# Altium project HAB_V01R01.PrjPCB
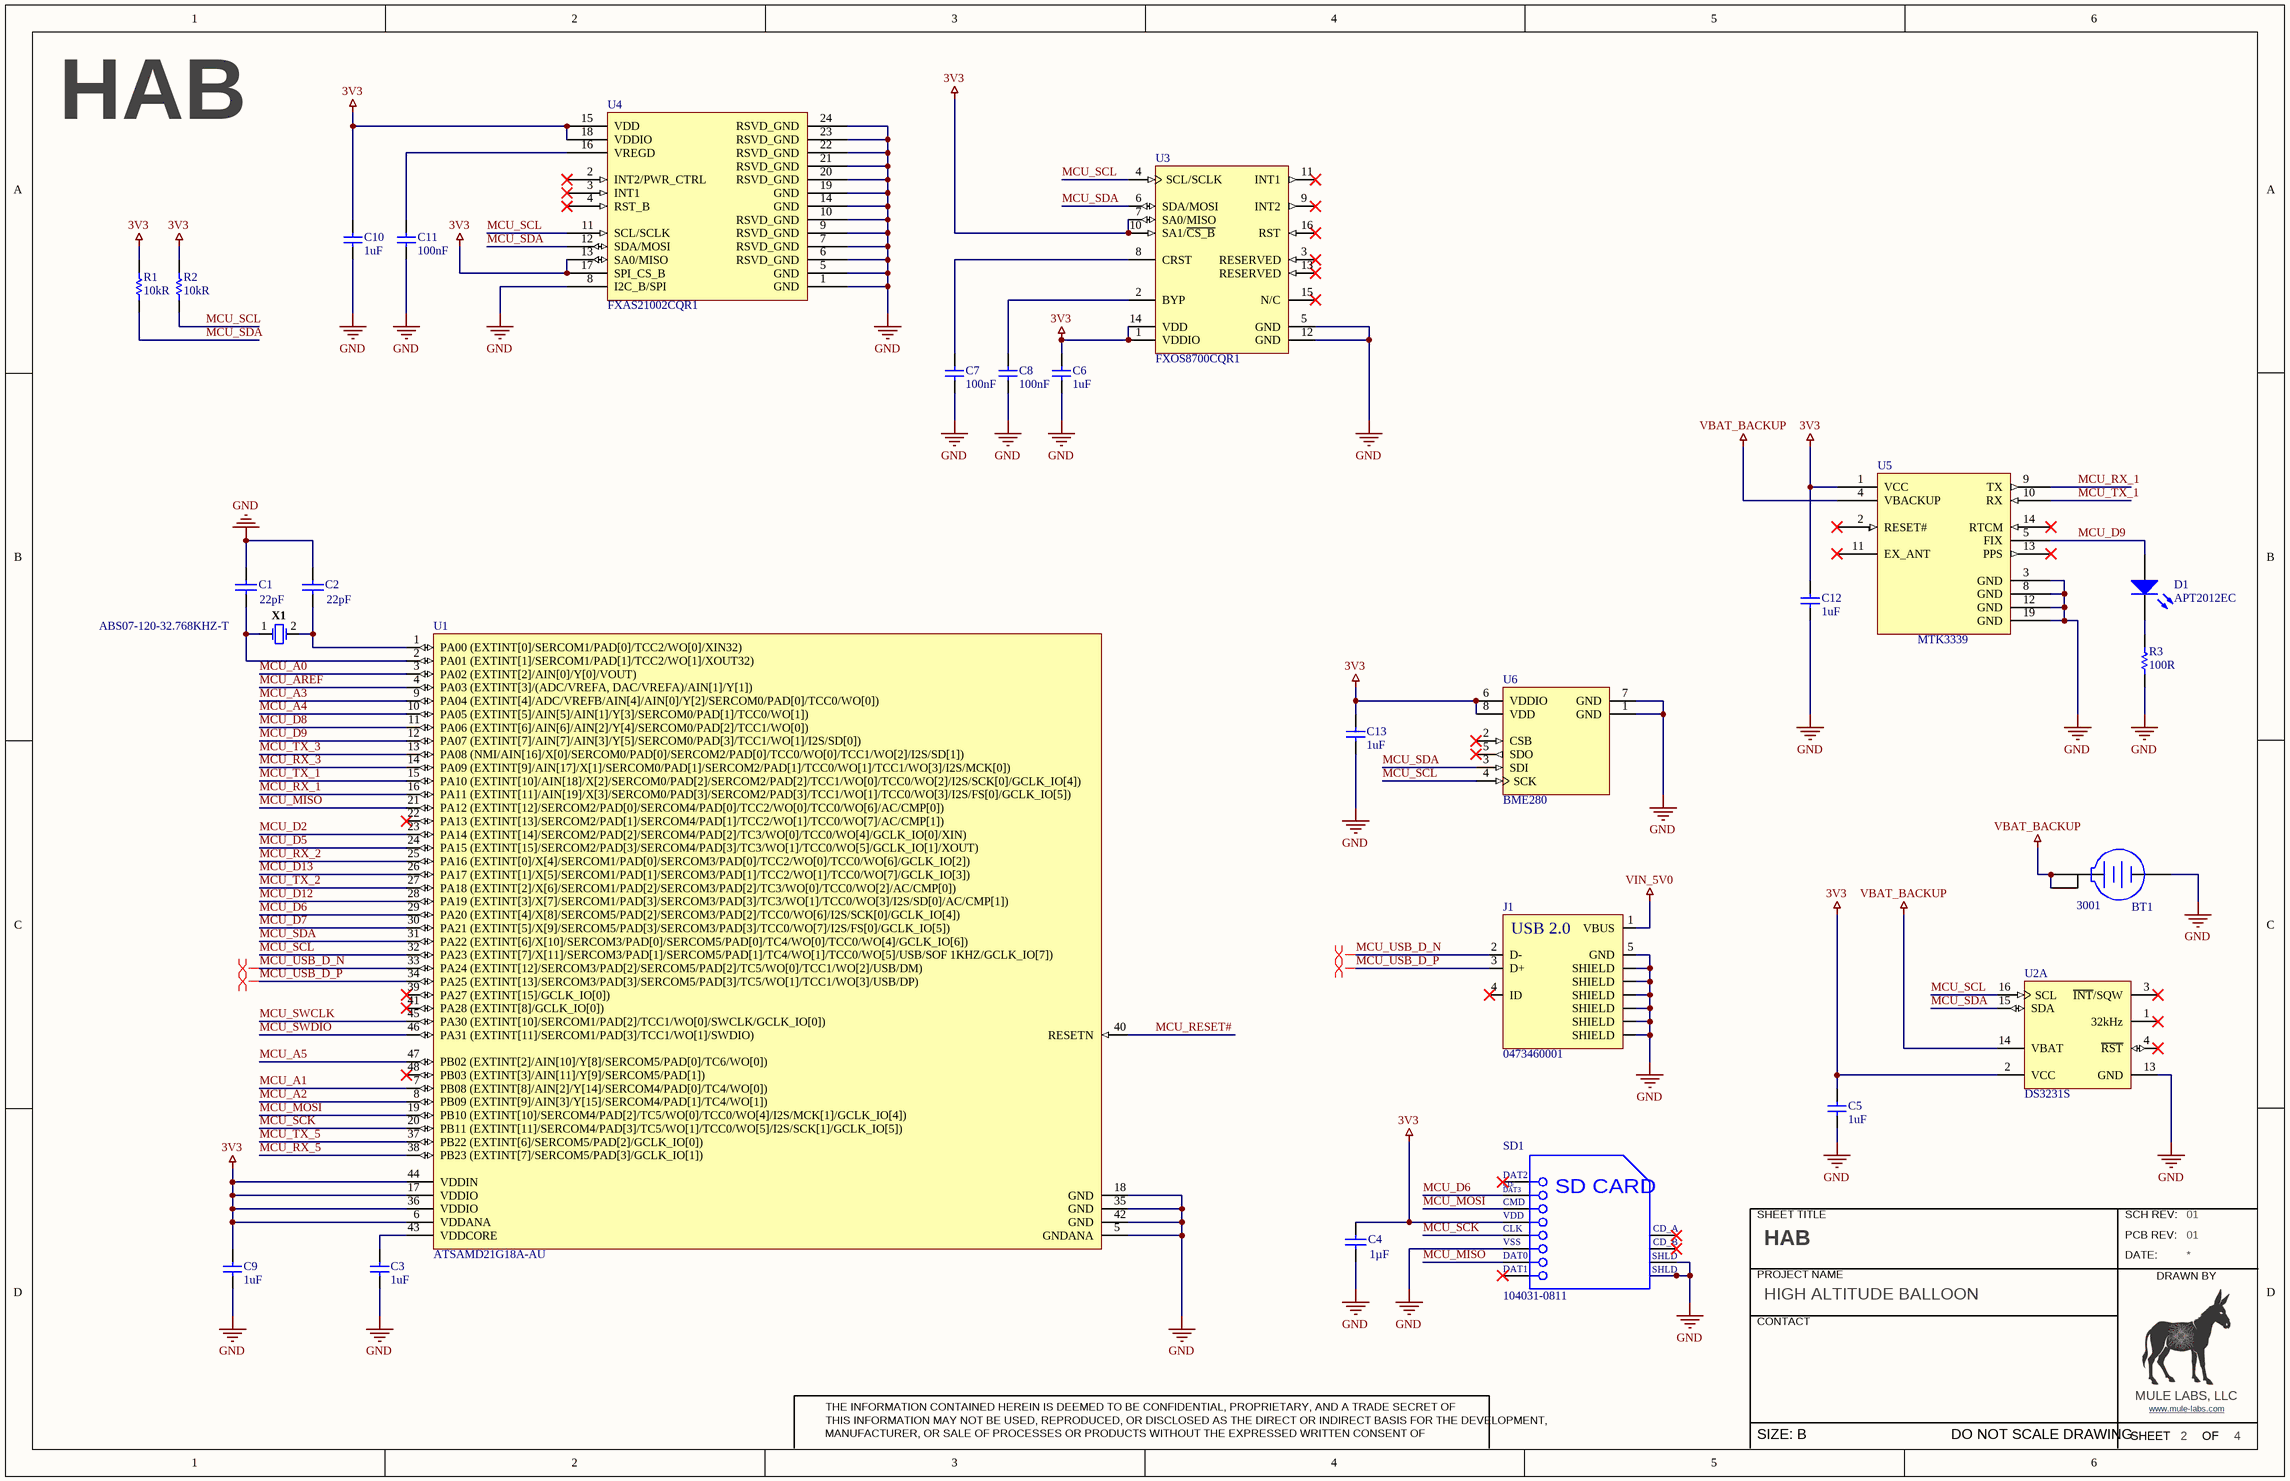
[diagram p0: [02] - HAB.SchDoc]
1 sheet, 27 parts. Net scope: global (net labels, ports and power ports of the same name join across sheets).
Board file: HAB_V01R01.PcbDoc

## Sheet [02] - HAB.SchDoc: HAB
size 433 x 279 mm; Author: ZAG; DrawnBy: ZAG; SheetNumber: 2; SheetTotal: 4; PageSetup: Record=PageOptions|CenterHorizontal=True|CenterVertical=True|PrintScale=0.96|XCorrection=1.00|YCorrection=1.00|PrintKind=2|BorderSize=5000000|LeftOffset=0|BottomOffset=0|Orientation=2|PaperLength=4318|PaperWidth=2794|Scale=100|PaperSource=15|PrintQuality=600|MediaType=1|DitherType=10|PaperKind=11x17|PrintScaleMode=1; SchRevision: 01; PCBRevision: 01; Project: HIGH ALTITUDE BALLOON; SchStatus: PRELIMINARY

### Parts
BT1  3001  [KSTN-3001_V]
C1  value 22pF  [CAPC2013X100X30ML20]  (hidden comment: GRM21A5C2E220JW01D)
C2  value 22pF  [CAPC2013X100X30ML20]  (hidden comment: GRM21A5C2E220JW01D)
C3  1uF  [INCH 0805 - METRIC 2012 - H140]
C4  Capacitance: 1µF  [CAPC2013X135X45ML10T25]  (hidden comment: GRM21BR71C105KA01L)
C5  1uF  [INCH 0805 - METRIC 2012 - H140]
C6  1uF  [INCH 0805 - METRIC 2012 - H140]
C7  100nF  [INCH 0805 - METRIC 2012 - H120]
C8  100nF  [INCH 0805 - METRIC 2012 - H120]
C9  1uF  [INCH 0805 - METRIC 2012 - H140]
C10  1uF  [INCH 0805 - METRIC 2012 - H140]
C11  100nF  [INCH 0805 - METRIC 2012 - H120]
C12  1uF  [INCH 0805 - METRIC 2012 - H140]
C13  1uF  [INCH 0805 - METRIC 2012 - H140]
D1  APT2012EC  [LED - 0805 - GREEN]
J1  0473460001  [MOLEX_047346-0001]
R1  10kR  [INCH 0805 - METRIC 2012 - H070]
R2  10kR  [INCH 0805 - METRIC 2012 - H070]
R3  100R  [INCH 0805 - METRIC 2012 - H070]
SD1  104031-0811  [MOLX-104031-0811_V]
U1  ATSAMD21G18A-AU  [ATML-TQFP48_M]
U2  DS3231S  [W16-H2_L]  (part A of 2)
U3  FXOS8700CQR1  [FREE-QFN-16-3000X3000DE_V]
U4  FXAS21002CQR1  [FXAS21002CQR1]
U5  MTK3339  [MTK3339]
U6  BME280  [BOSC-BME280-8_V]
X1  ABS07-120-32.768KHZ-T  [ABRA-ABS07_A_V]

### Nets
3V3: C4.1 C5.2 C6.2 C9.2 C10.2 C12.2 C13.2 R1.2 R2.2 SD1.4(VDD) U1.6(VDDANA) U1.17(VDDIO) U1.36(VDDIO) U1.44(VDDIN) U2.2(VCC) U3.1(VDDIO) U3.7(SA0/MISO) U3.10(SA1/~{CS_B}) U3.14(VDD) U4.13(SA0/MISO) U4.15(VDD) U4.17(SPI_CS_B) U4.18(VDDIO) U5.1(VCC) U6.6(VDDIO) U6.8(VDD)
GND: BT1.3(-) C1.2 C2.2 C3.1 C4.2 C5.1 C6.1 C7.1 C8.1 C9.1 C10.1 C11.1 C12.1 C13.1 J1.0(SHIELD) J1.5(GND) R3.1 SD1.6(VSS2) SD1.11(SHLD1) SD1.12(SHLD2) U1.5(GNDANA) U1.18(GND) U1.35(GND) U1.42(GND) U2.13(GND) U3.5(GND) U3.12(GND) U4.1(GND) U4.5(GND) U4.6(RSVD_GND) U4.7(RSVD_GND) U4.8(I2C_B/SPI) U4.9(RSVD_GND) U4.10(RSVD_GND) U4.14(GND) U4.19(GND) U4.20(RSVD_GND) U4.21(RSVD_GND) U4.22(RSVD_GND) U4.23(RSVD_GND) U4.24(RSVD_GND) U5.3(GND) U5.8(GND) U5.12(GND) U5.19(GND) U6.1(GND) U6.7(GND)
VBAT_BACKUP: BT1.1(+) BT1.2(+) U2.14(VBAT) U5.4(VBACKUP)
VIN_5V0: J1.1(VBUS)
MCU_A0: U1.3(PA02_(EXTINT[2]/AIN[0]/Y[0]/VOUT))
MCU_A1: U1.7(PB08_(EXTINT[8]/AIN[2]/Y[14]/SERCOM4/PAD[0]/TC4/WO[0]))
MCU_A2: U1.8(PB09_(EXTINT[9]/AIN[3]/Y[15]/SERCOM4/PAD[1]/TC4/WO[1]))
MCU_A3: U1.9(PA04_(EXTINT[4]/ADC/VREFB/AIN[4]/AIN[0]/Y[2]/SERCOM0/PAD[0]/TCC0/WO[0]))
MCU_A4: U1.10(PA05_(EXTINT[5]/AIN[5]/AIN[1]/Y[3]/SERCOM0/PAD[1]/TCC0/WO[1]))
MCU_A5: U1.47(PB02_(EXTINT[2]/AIN[10]/Y[8]/SERCOM5/PAD[0]/TC6/WO[0]))
MCU_AREF: U1.4(PA03_(EXTINT[3]/(ADC/VREFA,_DAC/VREFA)/AIN[1]/Y[1]))
MCU_D2: U1.23(PA14_(EXTINT[14]/SERCOM2/PAD[2]/SERCOM4/PAD[2]/TC3/WO[0]/TCC0/WO[4]/GCLK_IO[0]/XIN))
MCU_D5: U1.24(PA15_(EXTINT[15]/SERCOM2/PAD[3]/SERCOM4/PAD[3]/TC3/WO[1]/TCC0/WO[5]/GCLK_IO[1]/XOUT))
MCU_D6: SD1.2(CMD) U1.29(PA20_(EXTINT[4]/X[8]/SERCOM5/PAD[2]/SERCOM3/PAD[2]/TCC0/WO[6]/I2S/SCK[0]/GCLK_IO[4]))
MCU_D7: U1.30(PA21_(EXTINT[5]/X[9]/SERCOM5/PAD[3]/SERCOM3/PAD[3]/TCC0/WO[7]/I2S/FS[0]/GCLK_IO[5]))
MCU_D8: U1.11(PA06_(EXTINT[6]/AIN[6]/AIN[2]/Y[4]/SERCOM0/PAD[2]/TCC1/WO[0]))
MCU_D9: D1.A U1.12(PA07_(EXTINT[7]/AIN[7]/AIN[3]/Y[5]/SERCOM0/PAD[3]/TCC1/WO[1]/I2S/SD[0])) U5.5(FIX)
MCU_D12: U1.28(PA19_(EXTINT[3]/X[7]/SERCOM1/PAD[3]/SERCOM3/PAD[3]/TC3/WO[1]/TCC0/WO[3]/I2S/SD[0]/AC/CMP[1]))
MCU_D13: U1.26(PA17_(EXTINT[1]/X[5]/SERCOM1/PAD[1]/SERCOM3/PAD[1]/TCC2/WO[1]/TCC0/WO[7]/GCLK_IO[3]))
MCU_MISO: SD1.7(DAT0) U1.21(PA12_(EXTINT[12]/SERCOM2/PAD[0]/SERCOM4/PAD[0]/TCC2/WO[0]/TCC0/WO[6]/AC/CMP[0]))
MCU_MOSI: SD1.3(VSS1) U1.19(PB10_(EXTINT[10]/SERCOM4/PAD[2]/TC5/WO[0]/TCC0/WO[4]/I2S/MCK[1]/GCLK_IO[4]))
MCU_RESET#: U1.40(RESETN)
MCU_RX_1: U1.16(PA11_(EXTINT[11]/AIN[19]/X[3]/SERCOM0/PAD[3]/SERCOM2/PAD[3]/TCC1/WO[1]/TCC0/WO[3]/I2S/FS[0]/GCLK_IO[5])) U5.9(TX)
MCU_RX_2: U1.25(PA16_(EXTINT[0]/X[4]/SERCOM1/PAD[0]/SERCOM3/PAD[0]/TCC2/WO[0]/TCC0/WO[6]/GCLK_IO[2]))
MCU_RX_3: U1.14(PA09_(EXTINT[9]/AIN[17]/X[1]/SERCOM0/PAD[1]/SERCOM2/PAD[1]/TCC0/WO[1]/TCC1/WO[3]/I2S/MCK[0]))
MCU_RX_5: U1.38(PB23_(EXTINT[7]/SERCOM5/PAD[3]/GCLK_IO[1]))
MCU_SCK: SD1.5(CLK) U1.20(PB11_(EXTINT[11]/SERCOM4/PAD[3]/TC5/WO[1]/TCC0/WO[5]/I2S/SCK[1]/GCLK_IO[5]))
MCU_SCL: R2.1 U1.32(PA23_(EXTINT[7]/X[11]/SERCOM3/PAD[1]/SERCOM5/PAD[1]/TC4/WO[1]/TCC0/WO[5]/USB/SOF_1KHZ/GCLK_IO[7])) U2.16(SCL) U3.4(SCL/SCLK) U4.11(SCL/SCLK) U6.4(SCK)
MCU_SDA: R1.1 U1.31(PA22_(EXTINT[6]/X[10]/SERCOM3/PAD[0]/SERCOM5/PAD[0]/TC4/WO[0]/TCC0/WO[4]/GCLK_IO[6])) U2.15(SDA) U3.6(SDA/MOSI) U4.12(SDA/MOSI) U6.3(SDI)
MCU_SWCLK: U1.45(PA30_(EXTINT[10]/SERCOM1/PAD[2]/TCC1/WO[0]/SWCLK/GCLK_IO[0]))
MCU_SWDIO: U1.46(PA31_(EXTINT[11]/SERCOM1/PAD[3]/TCC1/WO[1]/SWDIO))
MCU_TX_1: U1.15(PA10_(EXTINT[10]/AIN[18]/X[2]/SERCOM0/PAD[2]/SERCOM2/PAD[2]/TCC1/WO[0]/TCC0/WO[2]/I2S/SCK[0]/GCLK_IO[4])) U5.10(RX)
MCU_TX_2: U1.27(PA18_(EXTINT[2]/X[6]/SERCOM1/PAD[2]/SERCOM3/PAD[2]/TC3/WO[0]/TCC0/WO[2]/AC/CMP[0]))
MCU_TX_3: U1.13(PA08_(NMI/AIN[16]/X[0]/SERCOM0/PAD[0]/SERCOM2/PAD[0]/TCC0/WO[0]/TCC1/WO[2]/I2S/SD[1]))
MCU_TX_5: U1.37(PB22_(EXTINT[6]/SERCOM5/PAD[2]/GCLK_IO[0]))
MCU_USB_D_N: J1.2(D-) U1.33(PA24_(EXTINT[12]/SERCOM3/PAD[2]/SERCOM5/PAD[2]/TC5/WO[0]/TCC1/WO[2]/USB/DM))
MCU_USB_D_P: J1.3(D+) U1.34(PA25_(EXTINT[13]/SERCOM3/PAD[3]/SERCOM5/PAD[3]/TC5/WO[1]/TCC1/WO[3]/USB/DP))
NetC1_1: C1.1 U1.2(PA01_(EXTINT[1]/SERCOM1/PAD[1]/TCC2/WO[1]/XOUT32)) X1.1
NetC2_1: C2.1 U1.1(PA00_(EXTINT[0]/SERCOM1/PAD[0]/TCC2/WO[0]/XIN32)) X1.2
NetC3_2: C3.2 U1.43(VDDCORE)
NetC7_2: C7.2 U3.8(CRST)
NetC8_2: C8.2 U3.2(BYP)
NetC11_2: C11.2 U4.16(VREGD)
NetD1_C: D1.C R3.2

Not connected (* = marked no-connect by the designer): J1 4(ID)*; SD1 1(CD/DAT3)* 8(DAT1)* 9(CD_A)* 10(CD_B)*; U1 22(PA13_(EXTINT[13]/SERCOM2/PAD[1]/SERCOM4/PAD[1]/TCC2/WO[1]/TCC0/WO[7]/AC/CMP[1]))* 39(PA27_(EXTINT[15]/GCLK_IO[0]))* 41(PA28_(EXTINT[8]/GCLK_IO[0]))* 48(PB03_(EXTINT[3]/AIN[11]/Y[9]/SERCOM5/PAD[1]))*; U2 1(32kHz)* 3(~{INT}/SQW)* 4(~{RST})*; U3 3(RESERVED)* 9(INT2)* 11(INT1)* 13(RESERVED)* 15(N/C)* 16(RST)*; U4 2(INT2/PWR_CTRL)* 3(INT1)* 4(RST_B)*; U5 2(RESET#)* 11(EX_ANT)* 13(PPS)* 14(RTCM)*; U6 2(CSB)* 5(SDO)*

### Layout directives
differential pair: MCU_USB_D_N, MCU_USB_D_P

### Notes on the sheet
- SHEET TITLE
- SCH REV:
- PROJECT NAME
- PCB REV:
- DATE:
- DRAWN BY
- CONTACT
- MANUFACTURER, OR SALE OF PROCESSES OR PRODUCTS WITHOUT THE EXPRESSED WRITTEN CONSENT OF
- THE INFORMATION CONTAINED HEREIN IS DEEMED TO BE CONFIDENTIAL, PROPRIETARY, AND A TRADE SECRET OF
- THIS INFORMATION MAY NOT BE USED, REPRODUCED, OR DISCLOSED AS THE DIRECT OR INDIRECT BASIS FOR THE DEVELOPMENT,
- SHEET
- MULE LABS, LLC
- www.mule-labs.com <http://www.mule-labs.com>
- OF
- SIZE: B
- DO NOT SCALE DRAWING
- (in symbol 0473460001) USB 2.0
- (in symbol CMP-2000-05825-1) DAT2; CD/; DAT3; SD CARD; VSS; SHLD

### Library data of the parts
BT1 = CMP-2000-05463-1: Holder Battery Coin, 12 mm, 2-Pin THD, RoHS; Manufacturer: Keystone; Package Reference: 3001; Package Description: 2-Pin Through Hole Device, Body 13.21 x 12.07 mm; Datasheet Version: Rev. H, 09/2006; Datasheet URL: https://datasheet.ciiva.com/3/3001-3954.pdf; Mounting Technology: ThroughHole; Manufacturer URL: http://www.keyelco.com/
C1 C2 = CMP-2007-03977-1: Manufacturer: Murata; Part Number: GRM21A5C2E220JW01D
C3 C5 C6 C9 C10 C12 C13 = GCM21BR71E105KA56L: CAP SMD 1uF 25V 10% 0805; Manufacturer: Murata; Dielectric: X7R; Supplier 1: Digi-Key; Manufacturer Part Number: GCM21BR71E105KA56L; RoHS: Yes; Category: Ceramic Capacitors; Stock 1: 1572955; Pricing 1: 1=0.33000, 10=0.22500, 100=0.12760, 500=0.09004, 1000=0.07878 (USD); Mount: Surface Mount; Case/Package: 0805; Case Code (Metric): 2012; Case Code (Imperial): 0805; Min Operating Temperature: -55°C; Max Operating Temperature: 125°C; Termination: SMD/SMT; Voltage: 25V; Package Quantity: 3000; Capacitance: 1uF; Voltage Rating: 25V; Tolerance: 10%; Packaging: Tape and Reel; Voltage Rating (DC): 25V; Length: 2mm; Height: 1.25mm; Thickness: 0.055inch; Depth: 1.25mm; Width: 0.049inch; Ratings: AEC-Q200; Radiation Hardening: No; REACH SVHC: No SVHC; Lead Free: Lead Free; ComponentLink1URL: https://datasheet.ciiva.com/3778/359gcm21br71e105ka5623-3778560.pdf?src-supplier=Arrow; ComponentLink1Description: https://datasheet.ciiva.com/3778/359gcm21br71e105ka5623-3778560.pdf?src-supplier=Arrow; ComponentLink2URL: https://datasheet.ciiva.com/16624/product-16624576.pdf?src-supplier=Avnet+Europe; ComponentLink2Description: https://datasheet.ciiva.com/16624/product-16624576.pdf?src-supplier=Avnet+Europe; ComponentLink3URL: https://datasheet.ciiva.com/18183/getdatasheetpartid-153106-18183696.pdf?src-supplier=Verical; ComponentLink3Description: https://datasheet.ciiva.com/18183/getdatasheetpartid-153106-18183696.pdf?src-supplier=Verical; ComponentLink4URL: https://datasheet.ciiva.com/11789/0900766b80ef92d0-11789092.pdf?src-supplier=RSComponents; ComponentLink4Description: https://datasheet.ciiva.com/11789/0900766b80ef92d0-11789092.pdf?src-supplier=RSComponents; ComponentLink5URL: https://datasheet.ciiva.com/137/product-137199.pdf?src-supplier=Digi-Key; ComponentLink5Description: https://datasheet.ciiva.com/137/product-137199.pdf?src-supplier=Digi-Key; ComponentLink6URL: https://datasheet.ciiva.com/137/product-137200.pdf?src-supplier=Digi-Key; ComponentLink6Description: https://datasheet.ciiva.com/137/product-137200.pdf?src-supplier=Digi-Key; ComponentLink7URL: https://datasheet.ciiva.com/137/product-137201.pdf?src-supplier=Digi-Key; ComponentLink7Description: https://datasheet.ciiva.com/137/product-137201.pdf?src-supplier=Digi-Key; ComponentLink8URL: https://datasheet.ciiva.com/2989/product-2989245.pdf?src-supplier=Avnet; ComponentLink8Description: https://datasheet.ciiva.com/2989/product-2989245.pdf?src-supplier=Avnet; ComponentLink9URL: https://datasheet.ciiva.com/2989/product-2989246.pdf?src-supplier=Avnet; ComponentLink9Description: https://datasheet.ciiva.com/2989/product-2989246.pdf?src-supplier=Avnet; Supplier Part Number 1: 490-4785-1-ND
C4 = CMP-2000-04946-1: Multilayer Ceramic Capacitor, 1 uF, +/- 10%, 16 V, -55 to 125 degC, 0805 (2012 Metric), RoHS, Tape and Reel; Manufacturer: Murata; Dielectric: X7R; Rated Voltage: 16V; Package Description: 2-Pin Surface Mount Device, Body 2 x 1.25 mm; Datasheet Version: Mar-08; Package Reference: 805; Datasheet URL: https://datasheet.ciiva.com/34302/1858922-34302874.pdf; Case Size/Dimension: 0805; Tolerance (%): ±10%; Manufacturer URL: http://www.murata.com/
C7 C8 C11 = C0805C104K1RACTU: CAP CER 0.1UF 100V X7R 0805; Manufacturer: KEMET; Dielectric Material: Ceramic; Tolerance: 10%; Dissipation Factor: 2.5%; Supplier 1: Digi-Key; Manufacturer Part Number: C0805C104K1RACTU; Stock 1: 25000; Pricing 1: 1=0.33, 10=0.226, 100=0.1147, 500=0.07848, 1000=0.06943 (USD); Mount: Surface Mount,PCB; Case/Package: 0805; Number of Pins: 2; Case Code (Imperial): 0805; Case Code (Metric): 2012; Contact Plating: Tin,Matte; Min Operating Temperature: -55°C; Max Operating Temperature: 125°C; Capacitance: 100nF; Voltage Rating: 100V; Packaging: Tape and Reel; Package Quantity: 1; Voltage Rating (DC): 100V; Dielectric: X7R; Termination: SMD/SMT; Voltage: 100V; Length: 2mm; Height: 1mm; Width: 1.2mm; Lead Pitch: 0.75mm; Thickness: 0.043inch; Depth: 1.25mm; Radiation Hardening: No; REACH SVHC: No SVHC; ComponentLink1URL: https://datasheet.ciiva.com/7842/1776102-7842535.pdf; ComponentLink1Description: https://datasheet.ciiva.com/7842/1776102-7842535.pdf; ComponentLink2URL: https://datasheet.ciiva.com/14589/70095383-14589479.pdf; ComponentLink2Description: https://datasheet.ciiva.com/14589/70095383-14589479.pdf; ComponentLink3URL: https://datasheet.ciiva.com/5411/kem-c1002-x7r-smd-5411498.pdf; ComponentLink3Description: https://datasheet.ciiva.com/5411/kem-c1002-x7r-smd-5411498.pdf; Supplier Part Number 1: 399-3486-1-ND; Category: Capacitor
D1 = APT2012EC: LED RED CLEAR CHIP SMD; Manufacturer: Kingbright; Power Rating: 75mW; Luminous Intensity: 12mcd; Viewing Angle: 120°; Lens Style: Clear,Flat; Number of LEDs: 1; Wavelength: 625nm; Test Current: 20mA; Forward Voltage: 2V; Supplier 1: Digi-Key; Manufacturer Part Number: APT2012EC; RoHS: Yes; Category: LEDs; Stock 1: 35644; Pricing 1: 1=0.35000, 10=0.25700, 100=0.12150, 500=0.08100, 1000=0.06345 (USD); Mount: Surface Mount; Case/Package: 0805; Number of Pins: 2; Case Code (Metric): 2012; Color: Red; Case Code (Imperial): 0805; Lens Color: Clear; Min Operating Temperature: -40°C; Max Operating Temperature: 85°C; Packaging: Tape and Reel; Package Quantity: 1; Dominant Wavelength: 625nm; Illumination Color: Red; Forward Current: 20mA; Length: 2mm; Height: 0.75mm; Width: 1.25mm; Lead Free: Lead Free; ComponentLink1URL: https://datasheet.ciiva.com/2113/apt2012ec-2113812.pdf?src-supplier=Digi-Key; ComponentLink1Description: https://datasheet.ciiva.com/2113/apt2012ec-2113812.pdf?src-supplier=Digi-Key; ComponentLink2URL: https://datasheet.ciiva.com/4688/apt2012ec-35230-4688685.pdf?src-supplier=Mouser; ComponentLink2Description: https://datasheet.ciiva.com/4688/apt2012ec-35230-4688685.pdf?src-supplier=Mouser; ComponentLink3URL: https://datasheet.ciiva.com/2113/apt2012ec-2113813.pdf?src-supplier=Digi-Key; ComponentLink3Description: https://datasheet.ciiva.com/2113/apt2012ec-2113813.pdf?src-supplier=Digi-Key; ComponentLink4URL: https://datasheet.ciiva.com/2113/apt2012ec-2113814.pdf?src-supplier=Digi-Key; ComponentLink4Description: https://datasheet.ciiva.com/2113/apt2012ec-2113814.pdf?src-supplier=Digi-Key; Supplier Part Number 1: 754-1128-1-ND
J1 = 0473460001: Conn Micro USB Type B RCP 5 POS 0.65mm Solder RA SMD 5 Terminal 1 Port Embossed T/R; Manufacturer: Molex; Number of Contacts: 5; Gender: Receptacle; Number of Ports: 1; Max Voltage Rating (AC): 30V; Supplier 1: Digi-Key; Manufacturer Part Number: 0473460001; Stock 1: 27309; Pricing 1: 1=1, 10=0.877, 25=0.8252, 50=0.7906, 100=0.7563, 250=0.68752, 500=0.61876, 1000=0.55 (USD); Mount: Surface Mount,Horizontal; Contact Material: Copper Alloy; Contact Plating: Nickel,Gold; Housing Material: Polymer; Number of Terminals: 5; Min Operating Temperature: -30°C; Max Operating Temperature: 85°C; Packaging: Tape and Reel; Orientation: Right Angle; Package Quantity: 1; Termination: Solder; Connector Type: USB; Length: 7.8mm; Pitch: 0.65mm; Depth: 5.43mm; Radiation Hardening: No; ComponentLink1URL: https://datasheet.ciiva.com/6731/473460001-sd-6731041.pdf; ComponentLink1Description: https://datasheet.ciiva.com/6731/473460001-sd-6731041.pdf; ComponentLink2URL: https://datasheet.ciiva.com/16545/0473460001-io-connectors-16545778.pdf; ComponentLink2Description: https://datasheet.ciiva.com/16545/0473460001-io-connectors-16545778.pdf; ComponentLink3URL: https://datasheet.ciiva.com/3094/0473460001-io-connectors-3094381.pdf; ComponentLink3Description: https://datasheet.ciiva.com/3094/0473460001-io-connectors-3094381.pdf; Supplier Part Number 1: WM17141CT-ND; Category: Connector
R1 R2 = ERJ-P06F1002V: RES SMD 10kOHM 1% 1/2W 0805; Manufacturer: Panasonic; Power Rating: 500mW; Voltage Rating: 150V; Temperature Coefficient: 100ppm/°C; Supplier 1: Digi-Key; Manufacturer Part Number: ERJ-P06F1002V; RoHS: Yes; Category: Chip SMD Resistors; Stock 1: 119213; Pricing 1: 1=0.17000, 10=0.14800, 100=0.05770, 1000=0.02416, 2500=0.02214 (USD); Mount: Surface Mount; Case/Package: 0805; Case Code (Imperial): 0805; Case Code (Metric): 2012; Contact Plating: Tin; Min Operating Temperature: -55°C; Max Operating Temperature: 155°C; Resistance: 10kR; Packaging: Tape and Reel; Tolerance: 1%; Package Quantity: 5000; Termination: SMD/SMT; Military Standard: Not; Voltage Rating (DC): 150V; Composition: Thick Film; Length: 2mm; Height: 0.6mm; Width: 1.2mm; Depth: 1.25mm; Radiation Hardening: No; REACH SVHC: No SVHC; Lead Free: Lead Free; ComponentLink1URL: https://datasheet.ciiva.com/11811/0900766b812cb812-11811124.pdf?src-supplier=RSComponents; ComponentLink1Description: https://datasheet.ciiva.com/11811/0900766b812cb812-11811124.pdf?src-supplier=RSComponents; ComponentLink2URL: https://datasheet.ciiva.com/24069/aoa0000ce4-64075-24069191.pdf?src-supplier=Mouser; ComponentLink2Description: https://datasheet.ciiva.com/24069/aoa0000ce4-64075-24069191.pdf?src-supplier=Mouser; ComponentLink3URL: https://datasheet.ciiva.com/48426/erjp-series-eng-tds-48426779.pdf?src-supplier=Distrelec; ComponentLink3Description: https://datasheet.ciiva.com/48426/erjp-series-eng-tds-48426779.pdf?src-supplier=Distrelec; Supplier Part Number 1: P16059CT-ND
R3 = ERJ-P06J101V: RES SMD 100 OHM 5% 1/2W 0805; Manufacturer: Panasonic; Temperature Coefficient: 200ppm/°C; Power Rating: 500mW; Voltage Rating: 400V; Voltage Rating (DC): 150V; Supplier 1: Digi-Key; Manufacturer Part Number: ERJ-P06J101V; RoHS: Yes; Category: Chip SMD Resistors; Stock 1: 141947; Pricing 1: 1=0.11000, 10=0.10300, 100=0.03960, 1000=0.01742, 2500=0.01505 (USD); Mount: Surface Mount; Case/Package: 0805; Weight: 0.000194oz; Contact Plating: Tin; Case Code (Imperial): 0805; Case Code (Metric): 2012; Min Operating Temperature: -55°C; Max Operating Temperature: 155°C; Resistance: 100R; Tolerance: 5%; Composition: Thick Film; Packaging: Tape and Reel; Package Quantity: 1; Max Power Dissipation: 500mW; Number of Terminations: 2; Military Standard: Not; Termination: SMD/SMT; Features: Automotive AEC-Q200; Length: 2mm; Height: 0.6mm; Width: 1.2mm; Depth: 1.25mm; Lead Free: Lead Free; REACH SVHC: Unknown; ComponentLink1URL: https://datasheet.ciiva.com/11810/0900766b812cb812-11810156.pdf?src-supplier=RSComponents; ComponentLink1Description: https://datasheet.ciiva.com/11810/0900766b812cb812-11810156.pdf?src-supplier=RSComponents; ComponentLink2URL: https://datasheet.ciiva.com/16788/70068906-16788678.pdf?src-supplier=Allied+Electronics; ComponentLink2Description: https://datasheet.ciiva.com/16788/70068906-16788678.pdf?src-supplier=Allied+Electronics; ComponentLink3URL: https://datasheet.ciiva.com/7831/aoa0000ce4-7831000.pdf?src-supplier=Element14; ComponentLink3Description: https://datasheet.ciiva.com/7831/aoa0000ce4-7831000.pdf?src-supplier=Element14; ComponentLink4URL: https://datasheet.ciiva.com/16767/70068906-16767564.pdf?src-supplier=Allied+Electronics; ComponentLink4Description: https://datasheet.ciiva.com/16767/70068906-16767564.pdf?src-supplier=Allied+Electronics; ComponentLink5URL: https://datasheet.ciiva.com/9186/aoa0000ce4-9186844.pdf?src-supplier=Avnet; ComponentLink5Description: https://datasheet.ciiva.com/9186/aoa0000ce4-9186844.pdf?src-supplier=Avnet; ComponentLink6URL: https://datasheet.ciiva.com/24163/aoa0000ce4-64075-24163318.pdf?src-supplier=Mouser; ComponentLink6Description: https://datasheet.ciiva.com/24163/aoa0000ce4-64075-24163318.pdf?src-supplier=Mouser; ComponentLink7URL: https://datasheet.ciiva.com/17208/aoa0000ce4-17208010.pdf?src-supplier=Avnet+Europe; ComponentLink7Description: https://datasheet.ciiva.com/17208/aoa0000ce4-17208010.pdf?src-supplier=Avnet+Europe; Supplier Part Number 1: P100ADCT-ND
SD1 = CMP-2000-05825-1: Micro SD Card, RA, -25 to 85 degC, 8-Pin SMD, RoHS, Tape and Reel; Voltage Rating: 10VAC/DC; Number of Contacts: 8; Insertion - Extraction Style: Push-Pull; Pitch: 1.1mm; Mating Cycles: 10000; Brand: Molex; Current Rating: 500mA; Manufacturer URL: http://www.molex.com/; Card Type: microSD; Mounting Type: Standard; Height: 1.42mm; Mounting Technology: SurfaceMount; Contact Plating: Gold; Product Category: MemoryCardConnectors; Package Description: 8-Pin Surface Mount Device, Body 11.95 x 11.4 mm, Pitch 1.1 mm; Datasheet URL: http://www.molex.com/pdm_docs/sd/1040310811_sd.pdf; Termination Style: SMD; Length: 11.4mm; Housing Material: LiquidCrystalPolymer(LCP); Orientation: RightAngle; RoHS: True; Contact Material: PhosphorBronze; Datasheet Version: Rev. E, 04/2006; Packaging: Reel; Manufacturer: Molex; Series: 104031; Product: CardConnectors; Number of Rows: 1Row; Package Reference: 104031-0811
U1 = CMP-2100-03585-1: SMART ARM-Based Microcontroller, 1.62 to 3.63 V, 256 KB Flash, 32 KB SRAM, -40 to 85 degC, 48-Pin TQFP, RoHS, Tray; Manufacturer: Atmel; Max Frequency: 48MHz; Number of Timers/Counters: 6; Max Supply Voltage: 3.63V; Min Supply Voltage: 1.62V; Packaging: Tray; Datasheet Version: Rev. N, 10/2016; Datasheet URL: http://www.atmel.com/images/atmel-42181-sam-d21_datasheet.pdf; REACH SVHC: NoSVHC; RoHSCompliant: true; Max Operating Temperature: 85degC; Manufacturer URL: http://www.atmel.com/; Contact Plating: Tin; Frequency: 48MHz; Package Description: 48-Pin Thin Profile Plastic Quad Flat Package, Body 7 x 7 mm, Pitch 0.5 mm; Package Reference: TQFP48; Lead Free: LeadFree; Number of Pins: 48; Min Operating Temperature: -40degC; Case/Package: TQFP; Mount: SurfaceMount
U2 = CMP-0254-00244-1: Extremely Accurate I2C-Integrated Real-Time Clock/TCXO/Crystal, 16-Pin SO, 0 to 70 degC; Code_IPC: SOIC127P1030-16; ComponentLink2Description: Datasheet; ComponentLink1URL: http://www.maxim-ic.com; PackageDescription: 16-Pin Small-Outline IC, Wide (0.3in), 1.27 mm Pitch, SOIC (W); PackageReference: W16-H2; ComponentLink2URL: http://datasheets.maxim-ic.com/en/ds/DS3231.pdf; DatasheetVersion: Rev 8, Jul-2010; PackageVersion: revD, 2010; ComponentLink1Description: Manufacturer URL; ComponentLink3Description: Package Specification; Code_JEDEC: MS-013-AA; ComponentLink3URL: http://pdfserv.maxim-ic.com/package_dwgs/21-0042.PDF
U3 = CMP-2000-05129-1: 6-Axis Xtrinsic Sensor with Integrated Linear Accelerometer and Magnetometer, 1.95 to 3.6 V, -40 to 85 degC, 16-Pin QFN, RoHS, Tape and Reel; Manufacturer: Freescale; Supply Voltage - Min: 1.95V; Operating Supply Voltage: 1.95Vto3.6V; Unit Weight: 0.000808oz; Supply Voltage - Max: 3.6V; Brand: FreescaleSemiconductor; Sensing Axis: X,Y,Z; Output Type: Digital; Package / Case: QFN-16; Datasheet Version: Rev. 1, 06/2012; Factory Pack Quantity: 1000; Mounting Style: SMD/SMT; Datasheet URL: https://datasheet.ciiva.com/12175/fxos8700cq-60595-12175213.pdf; Type: 6AxisSensor; Maximum Operating Temperature: +85C; Manufacturer URL: http://www.nxp.com/; Package Description: 16-Pin Quad Flat No-lead Package, Body 3 x 3 mm, Pitch 0.5 mm; RoHS: Details; Package Reference: QFN-16; Tradename: Xtrinsic; Packaging: Reel; Minimum Operating Temperature: -40C; Product Category: BoardMountAccelerationSensors
U4 = FXAS21002CQR1: NXP Precision 3 Axis Gyro I2C; Supplier 1: Digi-Key; Supplier Part Number 1: FXAS21002CQR1CT-ND
U5 = MTK3339: Ultimate GPS Module 66 channel 10 Hz
U6 = CMP-2000-05073-1: Combined Humidity and Pressure Sensor, 1.71 to 3.6 V, -40 to 85 degC, 8-Pin SMD, RoHS, Tape and Reel; Manufacturer: Bosch Sensortec; Datasheet Version: Rev. 1.2, 10/2015; Datasheet URL: http://datasheet.octopart.com/BME280-Bosch-datasheet-58577763.pdf; Manufacturer URL: http://www.bosch-sensortec.com
X1 = CMP-2000-07587-1: Tuning Fork Crystal, 32.768 KHz, +/- 20 ppm, -40 to 85 degC, 2-Pin SMD, RoHS, Tape and Reel; Manufacturer: Abracon; Case\/Package: SMD/SMT; Series Resistance: 60KOhm; Frequency Tolerance: 20ppm; Load Capacitance: 6pF; ESR (Equivalent Series Resistance): 55KOhm; Max Operating Temperature: 85degC; Width: 0.061inch; Radiation Hardening: No; Lead Free: LeadFree; RoHSCompliant: True; Depth: 1.5mm; Datasheet URL: http://www.abracon.com/Resonators/ABS07-120-32.768kHz-T.pdf; Frequency: 32.768KHz; Termination: SMD/SMT; Manufacturer URL: http://www.abracon.com/; Package Quantity: 3000; Packaging: TapeandReel; Number of Pins: 2; Height: 0.035inch; Package Description: 2-Pin Surface Mount Device, Body 3.2 x 1.5 mm; Package Reference: ABS07; Mount: SurfaceMount; Tolerance: 20ppm; Mounting Technology: SurfaceMount; REACH SVHC: NoSVHC; Datasheet Version: 11/2014; Length: 3.2mm; Min Operating Temperature: -40degC

## Assembly variants
ORIGINAL: not fitted Q2 R36 R36 R37 R58 R60 R62 R95 R96 R97 R?